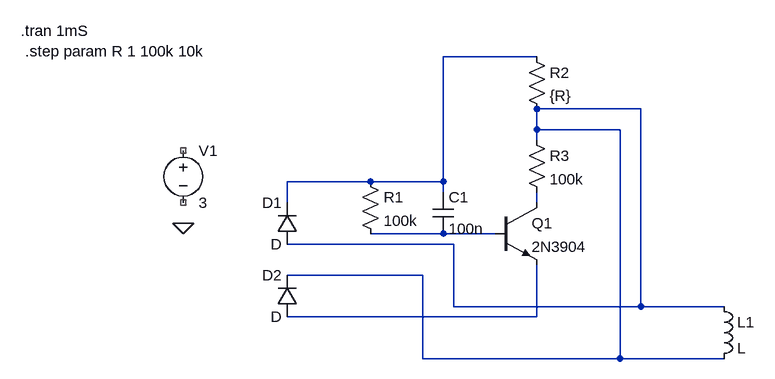
[diagram p0: schematic FoodTag_Power_Test.asc]
FoodTag_Power_Test.asc, the LTspice schematic file:
Version 4
SHEET 1 880 680
WIRE 208 -96 64 -96
WIRE 368 -16 208 -16
WIRE 208 16 208 -16
WIRE 336 16 208 16
WIRE 208 32 208 16
WIRE -48 96 -176 96
WIRE 64 96 64 -96
WIRE 64 96 -48 96
WIRE 64 112 64 96
WIRE -176 128 -176 96
WIRE 208 128 208 112
WIRE 64 176 -48 176
WIRE 144 176 64 176
WIRE 80 192 -176 192
WIRE 32 240 -176 240
WIRE 80 288 80 192
WIRE 368 288 368 -16
WIRE 368 288 80 288
WIRE 496 288 368 288
WIRE 208 304 208 224
WIRE 208 304 -176 304
WIRE 32 368 32 240
WIRE 336 368 336 16
WIRE 336 368 32 368
WIRE 496 368 336 368
FLAG -336 160 0
SYMBOL npn 144 128 R0
SYMATTR InstName Q1
SYMATTR Value 2N3904
SYMBOL cap 48 112 R0
SYMATTR InstName C1
SYMATTR Value 100n
SYMBOL res -64 80 R0
SYMATTR InstName R1
SYMATTR Value 100k
SYMBOL voltage -336 32 R0
WINDOW 123 0 0 Left 0
WINDOW 39 0 0 Left 0
SYMATTR InstName V1
SYMATTR Value 3
SYMBOL res 192 -112 R0
SYMATTR InstName R2
SYMATTR Value {R}
SYMBOL res 192 16 R0
SYMATTR InstName R3
SYMATTR Value 100k
SYMBOL ind 480 272 R0
SYMATTR InstName L1
SYMBOL diode -160 192 R180
WINDOW 0 24 64 Left 2
WINDOW 3 24 0 Left 2
SYMATTR InstName D1
SYMBOL diode -160 304 R180
WINDOW 0 24 64 Left 2
WINDOW 3 24 0 Left 2
SYMATTR InstName D2
TEXT -586 -136 Left 2 !.tran 1mS\n .step param R 1 100k 10k

The netlist it stands for:
* FoodTag_Power_Test.asc
Q1 N003 N004 N005 0 2N3904
C1 N001 N004 100n
R1 N001 N004 100k
V1 NC_01 NC_02 3
R2 N001 N002 {R}
R3 N002 N003 100k
L1 N002 N002 L
D1 N002 N001 D
D2 N005 N002 D
.model D D
.lib standard.dio
.model NPN NPN
.model PNP PNP
.lib standard.bjt
.tran 1mS
 .step param R 1 100k 10k
.backanno
.end